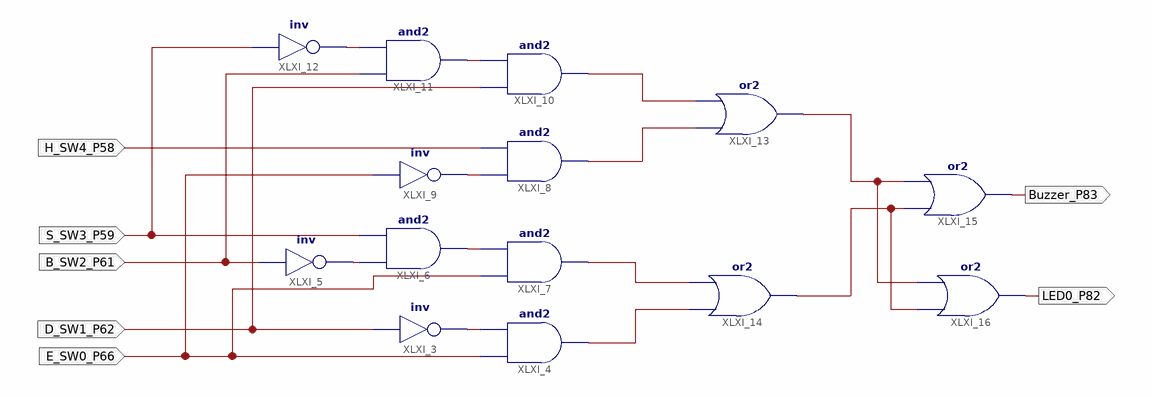
[diagram p0: schematic sheet 1]
// Xilinx ISE schematic lab4.sch (spartan6) as structural Verilog: 14 symbols, 7 ports
module lab4 (
  input  D_SW1_P62,
  input  B_SW2_P61,
  input  S_SW3_P59,
  input  E_SW0_P66,
  input  H_SW4_P58,
  output Buzzer_P83,
  output LED0_P82
);

  wire XLXN_1, XLXN_4, XLXN_6, XLXN_13, XLXN_17, XLXN_18, XLXN_22, XLXN_24, XLXN_25, XLXN_26, XLXN_28,
       XLXN_29;

  not XLXI_3 (XLXN_1, D_SW1_P62);
  and XLXI_4 (XLXN_26, E_SW0_P66, XLXN_1);
  not XLXI_5 (XLXN_4, B_SW2_P61);
  and XLXI_6 (XLXN_6, XLXN_4, S_SW3_P59);
  and XLXI_7 (XLXN_25, E_SW0_P66, XLXN_6);
  and XLXI_8 (XLXN_24, XLXN_13, H_SW4_P58);
  not XLXI_9 (XLXN_13, E_SW0_P66);
  and XLXI_10 (XLXN_22, D_SW1_P62, XLXN_17);
  and XLXI_11 (XLXN_17, B_SW2_P61, XLXN_18);
  not XLXI_12 (XLXN_18, S_SW3_P59);
  or XLXI_13 (XLXN_28, XLXN_24, XLXN_22);
  or XLXI_14 (XLXN_29, XLXN_26, XLXN_25);
  or XLXI_15 (Buzzer_P83, XLXN_29, XLXN_28);
  or XLXI_16 (LED0_P82, XLXN_29, XLXN_28);
endmodule
